# EAGLE schematic schematic_test (EAGLE 9.6.2)
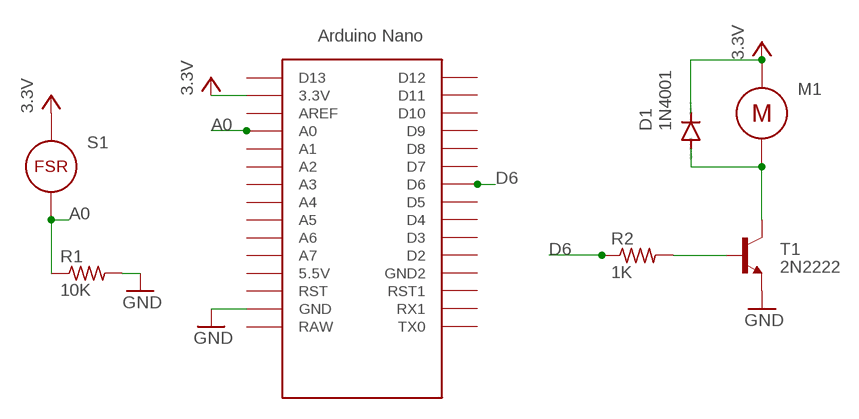
[diagram p0: schematic, sheet 1]

## Parts
D1  1N4001  1N5624  [DO201-15]
M1  308-100  [308-100]
R1  10K  R-US_0204/7  [0204/7]
R2  1K  R-US_0204/7  [0204/7]
S1  308-100  [308-100]
T1  2N2222  [TO92-EBC-OVAL]
U$1  NANO  [NANO]

## Nets
A0: R1.1 S1.NEG U$1.A0
D6: R2.1 U$1.D6
GND: R1.2 T1.E U$1.GND
N$1: D1.A M1.NEG T1.C
N$2: R2.2 T1.B
VCC: D1.C M1.POS S1.POS U$1.3.3V ; supply symbol labelled 3.3V
Unconnected: U$1.5V(5.5V) U$1.A1 U$1.A2 U$1.A3 U$1.A4 U$1.A5 U$1.A6 U$1.A7 U$1.AREF U$1.D2 U$1.D3 U$1.D4 U$1.D5 U$1.D7 U$1.D8 U$1.D9 U$1.D10 U$1.D11 U$1.D12 U$1.D13 U$1.GND1(GND2) U$1.ICSP1 U$1.ICSP2 U$1.ICSP3 U$1.ICSP4 U$1.ICSP5 U$1.ICSP6 U$1.RAW U$1.RST U$1.RST1 U$1.RX1 U$1.TX0

## Library data of the parts
D1 = diode:1N5624: DIODE controlled avalanche rectifier
M1 = motor:308-100: Pico Vibe; PRECISION_MICRODRIVES: 308-100
R1 R2 = rcl:R-US_: RESISTOR, American symbol; SPICEPREFIX: R
S1 = fsr:308-100: Pico Vibe; PRECISION_MICRODRIVES: 308-100
T1 = adafruit:2N2222: NPN TRANSISTOR Big oval pads
U$1 = Arduino-clone:NANO: Arduino Nano

## Module ARD
Ports: 

### Library data of the parts